# EAGLE design LeiraBoard (EAGLE 8.3.2)
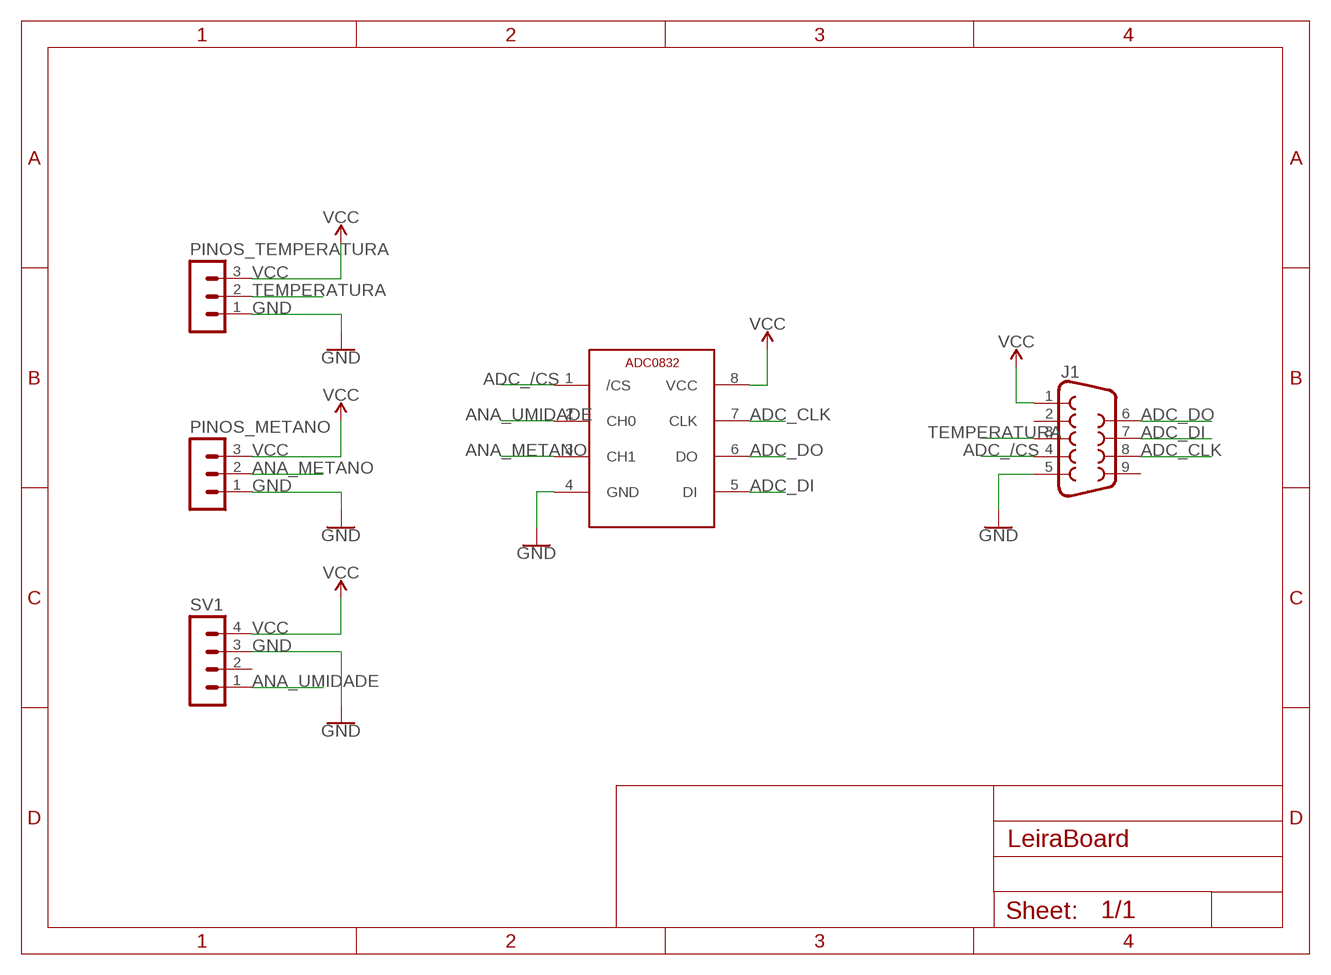
[diagram p0: schematic, sheet 1]

## Parts
J1  DB9MALE  [DB9_MALE]
PINOS_METANO  MA03-1  [MA03-1]
PINOS_TEMPERATURA  MA03-1  [MA03-1]
SV1  MA04-1  [MA04-1]
U$1  ADC8032  [DIL8]

## Nets
ADC_/CS: J1.4 U$1.1(/CS)
ADC_CLK: J1.8 U$1.7(CLK)
ADC_DI: J1.7 U$1.5(DI)
ADC_DO: J1.6 U$1.6(DO)
ANA_METANO: PINOS_METANO.2 U$1.3(CH1)
ANA_UMIDADE: SV1.1 U$1.2(CH0)
GND [alimentação]: J1.5 PINOS_METANO.1 PINOS_TEMPERATURA.1 SV1.3 U$1.4(GND)
TEMPERATURA: J1.3 PINOS_TEMPERATURA.2
VCC [alimentação]: J1.1 PINOS_METANO.3 PINOS_TEMPERATURA.3 SV1.4 U$1.8(VCC)
Unconnected: J1.2 J1.9 SV1.2

## Library data of the parts
J1 = Geisa:DB9: DB9 Connector Standard DB9 (D-Sub 9) serial connector. Can be used for CAN bus as well as RS485 and RS232. Footprint production proven. Here is the female version connector we sell at SparkFun: 9 Pin Female Serial Connector - PCB Mount <https://www.sparkfun.com/products/429> (PRT-00429) This connector has been used on the following SparkFun products: SparkFun RS232 Shifter - SMD <https://www.sparkfun.com/products/449> (PRT-00449) SparkFun RS232 Shifter SMD (No DB9) <https://www.sparkfun.com/products/8780> (PRT-08780); PROD_ID: CONN-09904
PINOS_METANO PINOS_TEMPERATURA = con-lstb:MA03-1: PIN HEADER; OC_FARNELL: unknown; OC_NEWARK: unknown
SV1 = con-lstb:MA04-1: PIN HEADER; OC_FARNELL: unknown; OC_NEWARK: unknown
U$1 = Geisa:ADC8032

## Net classes
0 default: width 0.508 mm
1 alimentação: width 1.016 mm

## Board
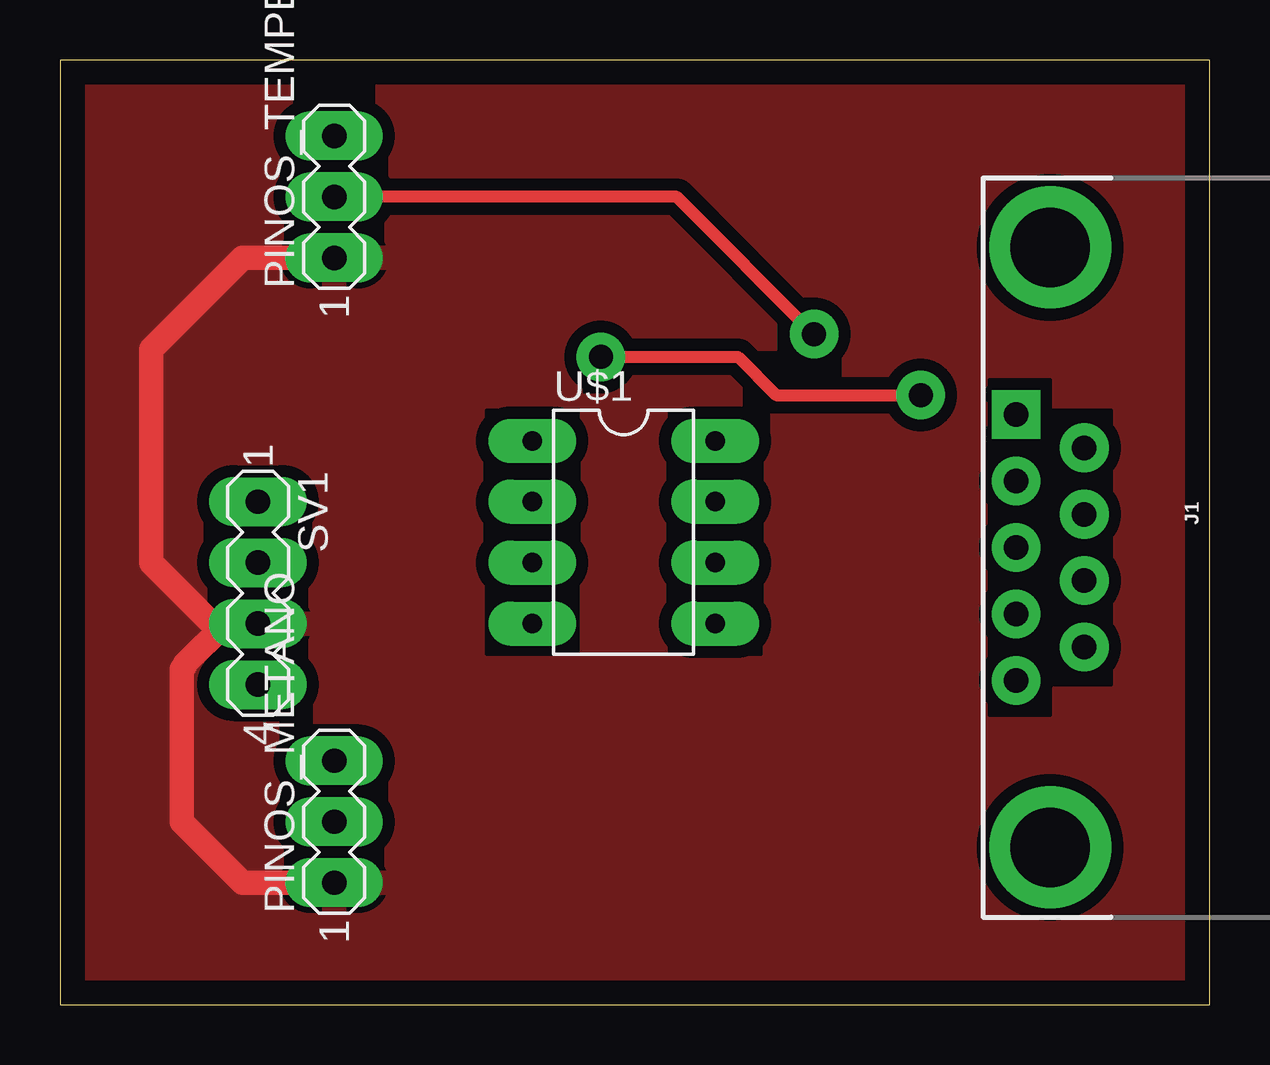
[diagram p1: board, top side]
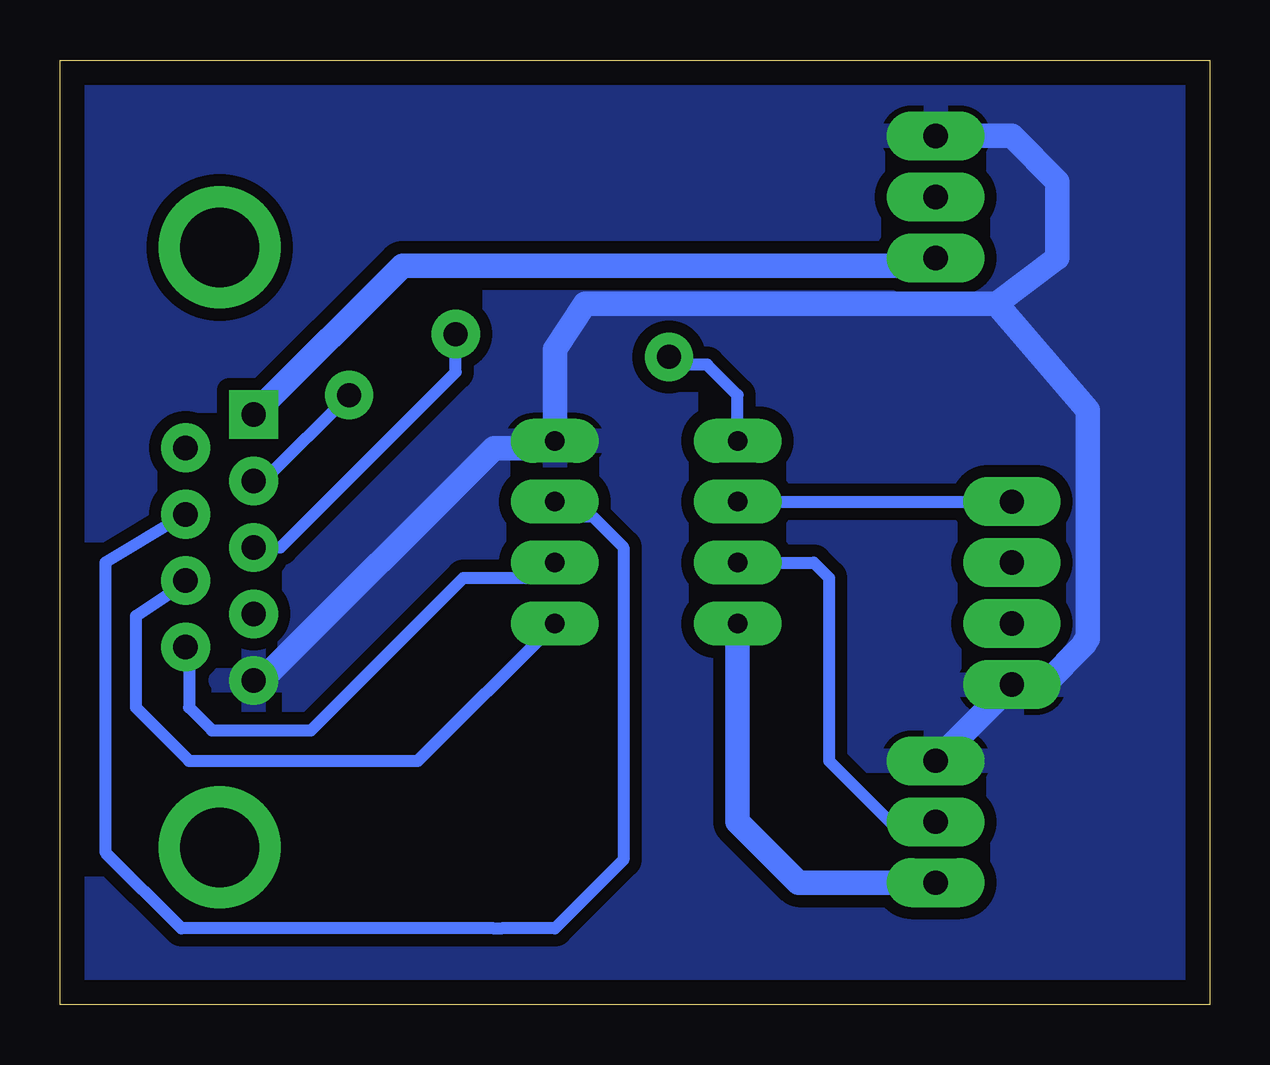
[diagram p2: board, bottom side, seen from below]

Size 47.93 x 39.36 mm. Coordinates in mm from the lower left corner, seen from the top.
Outline: 0,0 47.93,0 47.93,39.36 0,39.36 0,0
Copper layers (1*16): Top 0.035mm / dielectric 1.5mm / Bottom 0.035mm
Design rules "default *": minimum track width 20mil, minimum drill 1mm, track to track 20mil, track to pad 20mil, pad to pad 20mil, via to via 20mil, smd to smd 20mil, copper to edge 40mil, drill to drill 31.5mil, minimum pad ring 20mil, minimum via ring 20mil, stop-mask expansion 4mil, vias tented up to drill 0mil, thermal gap 10mil
tRestrict: area 38.7,12.1 to 41.3,26; area 41.3,13.3 to 43.8,24.8; area 17.8,14.6 to 21.6,24.8; area 25.4,14.6 to 29.2,24.8

### Footprints (pad centres in the part's own frame; a part is rotated, then mirrored left to right if it is on the bottom)
DB9_MALE = drill 1.016 pad 1.88: 1 5.54,-1.42; 2 2.77,-1.42; 3 0,-1.42; 4 -2.77,-1.42; 6 4.15,1.42; 7 1.38,1.42; 8 -1.38,1.42; 9 -4.15,1.42 | drill 1.016 pad 1.88 square: 5 -5.54,-1.42 | drill 3.302 pad 5.08: G1 -12.5,0; G2 12.5,0
MA03-1 = drill 1.016 long: 1 -2.54,0; 2 0,0; 3 2.54,0
MA04-1 = drill 1.016 long: 1 -3.81,0; 2 -1.27,0; 3 1.27,0; 4 3.81,0
DIL8 = drill 0.813 long: 1 -8.89,-3.81; 2 -6.35,-3.81; 3 -3.81,-3.81; 4 -1.27,-3.81; 5 -1.27,3.81; 6 -3.81,3.81; 7 -6.35,3.81; 8 -8.89,3.81

### Placement (x,y rotation side)
J1  41.27,19.05 270 top
PINOS_METANO  11.43,7.62 90 top
PINOS_TEMPERATURA  11.43,33.66 90 top
SV1  8.25,17.14 270 top
U$1  23.49,14.61 270 top

### Tracks (layer width: path | path; a pad name or v marks a point on that pad's centre or on a via)
ADC_/CS  (via drill 1)
  Top 0.508: v22.54,26.99 28.26,26.99 29.84,25.4 v35.88,25.4
  Bottom 0.508: 20,23.81 U$1.1 19.69,25.4 20.95,26.67 22.23,26.67 v22.54,26.99 | v35.88,25.4 39.37,21.91 39.69,21.91 J1.4
ADC_CLK
  Bottom 0.508: U$1.7 26.67,20.32 25.72,20.32 24.45,19.05 24.45,6.03 27.3,3.17 29.53,3.17 29.84,3.17 42.86,3.17 46.04,6.35 46.04,18.41 42.86,20.32 J1.8
ADC_DI
  Bottom 0.508: U$1.5 33.02,10.16 42.55,10.16 44.77,12.38 44.77,16.19 42.86,17.46 J1.7
ADC_DO
  Bottom 0.508: U$1.6 27.94,17.78 31.12,17.78 37.46,11.43 41.59,11.43 42.55,12.38 42.55,14.61 J1.6
ANA_METANO
  Bottom 0.508: U$1.3 16.51,18.41 15.88,17.78 15.88,10.16 13.34,7.62 PINOS_METANO.2
ANA_UMIDADE
  Bottom 0.508: U$1.2 SV1.1
GND
  Top 1.016: PINOS_TEMPERATURA.1 7.62,31.12 3.81,27.3 3.81,18.41 6.35,15.88 SV1.3 6.9,15.88 5.21,14.18 5.21,14.1 5.08,13.97 5.08,7.62 7.62,5.08 PINOS_METANO.1
  Bottom 1.016: J1.5 39.69,24.77 33.66,30.8 11.75,30.8 PINOS_TEMPERATURA.1 | U$1.4 19.69,7.62 17.14,5.08 PINOS_METANO.1
  pour Top: 0,39.37 47.62,39.37 48.26,0 0.63,0
TEMPERATURA  (via drill 1)
  Top 0.508: PINOS_TEMPERATURA.2 25.72,33.66 v31.43,27.94
  Bottom 0.508: v31.43,27.94 31.43,26.35 38.73,19.05 J1.3
VCC
  Bottom 1.016: J1.1 39.69,13.65 39.37,13.65 29.84,23.18 27.62,23.18 U$1.8 27.3,27.3 26.03,29.21 8.89,29.21 | 8.89,29.21 6.35,31.12 6.35,34.29 8.25,36.2 PINOS_TEMPERATURA.3 | 8.89,29.21 5.08,24.77 5.08,15.24 5.21,15.11 5.21,15.03 6.9,13.34 SV1.4 PINOS_METANO.3
  pour Bottom: 0,39.37 47.62,39.37 47.62,0 0,0